# EAGLE schematic LED-Controller (EAGLE 6.5.0)
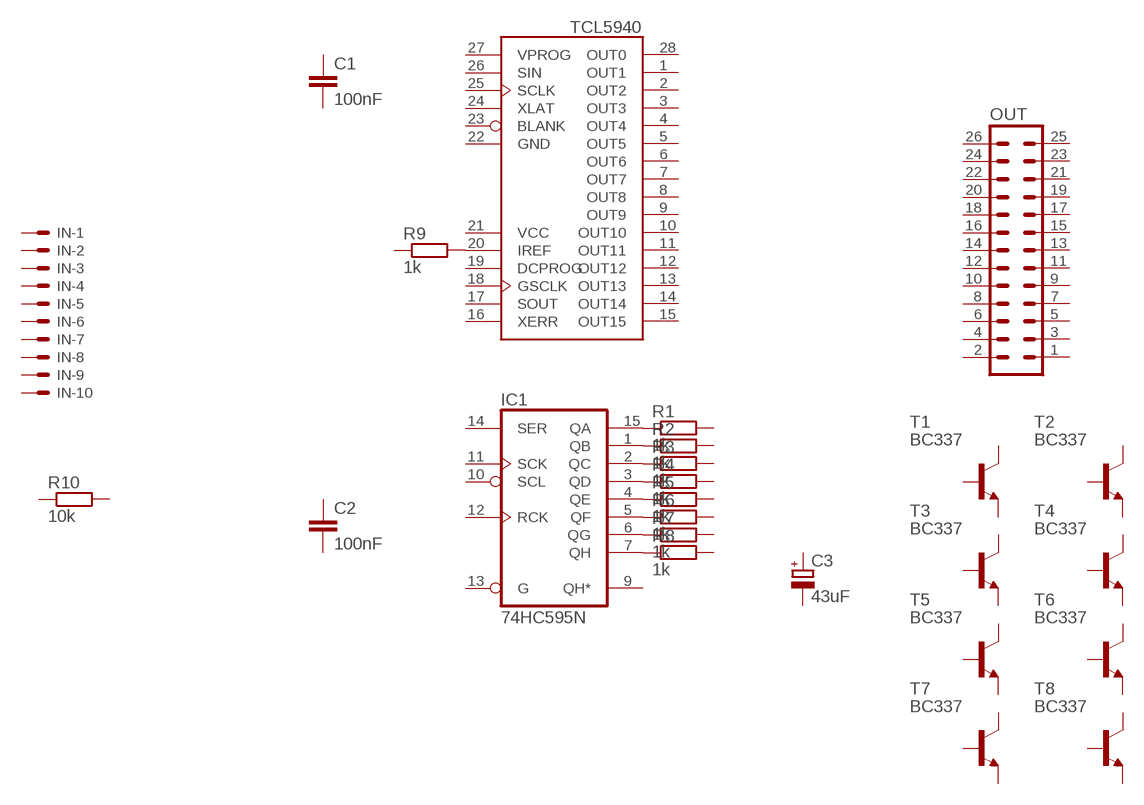
[diagram p0: schematic, sheet 1]

## Parts
C1  100nF  C-EU025-024X044  [C025-024X044]
C2  100nF  C-EU025-024X044  [C025-024X044]
C3  43uF  CPOL-EUE2,5-6E  [E2,5-6E]
IC1  74HC595N  [DIL16]
IC2  TCL5940  [DIP28]
IN  KK-156-10  [KK-156-10]
OUT  ML26  [ML26]
R1  1k  R-EU_0204/7  [0204/7]
R2  1k  R-EU_0204/7  [0204/7]
R3  1k  R-EU_0204/7  [0204/7]
R4  1k  R-EU_0204/7  [0204/7]
R5  1k  R-EU_0204/7  [0204/7]
R6  1k  R-EU_0204/7  [0204/7]
R7  1k  R-EU_0204/7  [0204/7]
R8  1k  R-EU_0204/7  [0204/7]
R9  1k  R-EU_0204/7  [0204/7]
R10  10k  R-EU_0204/7  [0204/7]
T1  BC337  [TO92]
T2  BC337  [TO92]
T3  BC337  [TO92]
T4  BC337  [TO92]
T5  BC337  [TO92]
T6  BC337  [TO92]
T7  BC337  [TO92]
T8  BC337  [TO92]

## Nets
N$1: IC1.15(QA) R1.1
N$2: IC1.1(QB) R2.1
N$3: IC1.2(QC) R3.1
N$4: IC1.3(QD) R4.1
N$5: IC1.4(QE) R5.1
N$6: IC1.5(QF) R6.1
N$7: IC1.6(QG) R7.1
N$8: IC1.7(QH) R8.1
N$9: IC2.20(IREF) R9.2
Unconnected: C1.1 C1.2 C2.1 C2.2 C3.+ C3.- IC1.9(QH*) IC1.10(SCL) IC1.11(SCK) IC1.12(RCK) IC1.13(G) IC1.14(SER) IC2.1(OUT1) IC2.2(OUT2) IC2.3(OUT3) IC2.4(OUT4) IC2.5(OUT5) IC2.6(OUT6) IC2.7(OUT7) IC2.8(OUT8) IC2.9(OUT9) IC2.10(OUT10) IC2.11(OUT11) IC2.12(OUT12) IC2.13(OUT13) IC2.14(OUT14) IC2.15(OUT15) IC2.16(XERR) IC2.17(SOUT) IC2.18(GSCLK) IC2.19(DCPROG) IC2.23(BLANK) IC2.24(XLAT) IC2.25(SCLK) IC2.26(SIN) IC2.27(VPROG) IC2.28(OUT0) IN.1 IN.2 IN.3 IN.4 IN.5 IN.6 IN.7 IN.8 IN.9 IN.10 OUT.1 OUT.2 OUT.3 OUT.4 OUT.5 OUT.6 OUT.7 OUT.8 OUT.9 OUT.10 OUT.11 OUT.12 OUT.13 OUT.14 OUT.15 OUT.16 OUT.17 OUT.18 OUT.19 OUT.20 OUT.21 OUT.22 OUT.23 OUT.24 OUT.25 OUT.26 R1.2 R2.2 R3.2 R4.2 R5.2 R6.2 R7.2 R8.2 R9.1 R10.1 R10.2 T1.1(E) T1.2(B) T1.3(C) T2.1(E) T2.2(B) T2.3(C) T3.1(E) T3.2(B) T3.3(C) T4.1(E) T4.2(B) T4.3(C) T5.1(E) T5.2(B) T5.3(C) T6.1(E) T6.2(B) T6.3(C) T7.1(E) T7.2(B) T7.3(C) T8.1(E) T8.2(B) T8.3(C)

## Power pins joined to a net without a drawn wire
GND: IC1.8(GND) IC2.22(GND)
VCC: IC1.16(VCC) IC2.21(VCC)

## Library data of the parts
C1 C2 = resistor:C-EU: CAPACITOR, European symbol
C3 = resistor:CPOL-EU: POLARIZED CAPACITOR, European symbol
IC1 = 74xx-eu:74*595: 8-bit SHIFT REGISTER, output latch
IC2 = tcl5940:TCL5940: 16-Channel 12-Bit LED Driver
IN = con-molex:KK-156-10: KK 156 HEADER Source: http://www.molex.com/pdm_docs/sd/026604100_sd.pdf; OC_FARNELL: unknown; OC_NEWARK: unknown
OUT = con-harting-ml:ML26: HARTING; OC_FARNELL: unknown; OC_NEWARK: unknown
R1-R10 = resistor:R-EU_: RESISTOR, European symbol
T1-T8 = transistor:BC337: NPN TRANSISTOR